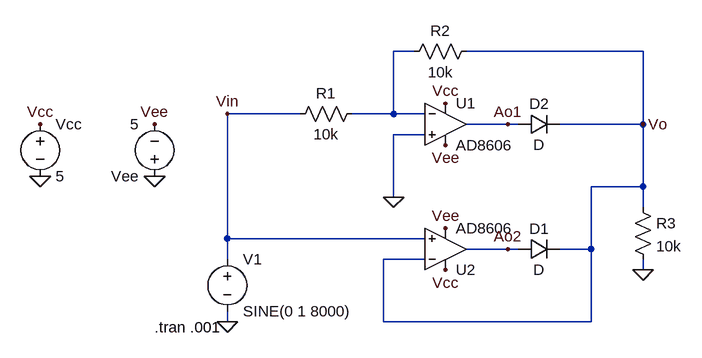
[diagram p0: schematic SuperDiodeFullWaveRectifier.asc]
SuperDiodeFullWaveRectifier.asc, the LTspice schematic file:
Version 4
SHEET 1 880 680
WIRE 160 32 128 32
WIRE 512 32 240 32
WIRE -16 128 -128 128
WIRE 128 128 128 32
WIRE 128 128 64 128
WIRE 176 128 128 128
WIRE 304 144 240 144
WIRE 320 144 304 144
WIRE 512 144 512 32
WIRE 512 144 384 144
WIRE 176 160 128 160
WIRE 512 240 512 144
WIRE 512 240 432 240
WIRE 128 256 128 160
WIRE 512 272 512 240
WIRE -128 320 -128 128
WIRE 176 320 -128 320
WIRE 304 336 240 336
WIRE 320 336 304 336
WIRE 432 336 432 240
WIRE 432 336 384 336
WIRE -128 352 -128 320
WIRE 176 352 112 352
WIRE 512 368 512 352
WIRE -128 448 -128 432
WIRE 112 448 112 352
WIRE 432 448 432 336
WIRE 432 448 112 448
FLAG -416 224 0
FLAG -240 224 0
FLAG 208 176 Vee
FLAG 208 112 Vcc
FLAG 512 368 0
FLAG 512 144 Vo
FLAG -128 128 Vin
FLAG -416 144 Vcc
FLAG -240 144 Vee
FLAG 128 256 0
FLAG 304 144 Ao1
FLAG 208 304 Vee
FLAG 208 368 Vcc
FLAG -128 448 0
FLAG 304 336 Ao2
SYMBOL voltage -416 128 R0
WINDOW 123 0 0 Left 0
WINDOW 39 0 0 Left 0
SYMATTR InstName Vcc
SYMATTR Value 5
SYMBOL voltage -240 240 R180
WINDOW 123 0 0 Left 0
WINDOW 39 0 0 Left 0
SYMATTR InstName Vee
SYMATTR Value 5
SYMBOL voltage -128 336 R0
WINDOW 123 0 0 Left 0
WINDOW 39 0 0 Left 0
SYMATTR InstName V1
SYMATTR Value SINE(0 1 8000)
SYMBOL res 496 256 R0
SYMATTR InstName R3
SYMATTR Value 10k
SYMBOL diode 320 160 R270
WINDOW 0 32 32 VTop 2
WINDOW 3 0 32 VBottom 2
SYMATTR InstName D2
SYMBOL OpAmps\\AD8606 208 80 R0
SYMATTR InstName U1
SYMBOL res 80 112 R90
WINDOW 0 0 56 VBottom 2
WINDOW 3 32 56 VTop 2
SYMATTR InstName R1
SYMATTR Value 10k
SYMBOL res 256 16 R90
WINDOW 0 0 56 VBottom 2
WINDOW 3 32 56 VTop 2
SYMATTR InstName R2
SYMATTR Value 10k
SYMBOL diode 320 352 R270
WINDOW 0 32 32 VTop 2
WINDOW 3 0 32 VBottom 2
SYMATTR InstName D1
SYMBOL OpAmps\\AD8606 208 400 M180
SYMATTR InstName U2
TEXT -240 456 Left 2 !.tran .001

The netlist it stands for:
* SuperDiodeFullWaveRectifier.asc
Vcc Vcc 0 5
Vee 0 Vee 5
V1 Vin 0 SINE(0 1 8000)
R3 Vo 0 10k
D2 Ao1 Vo D
XU1 0 N001 Vcc Vee Ao1 AD8606  ; pins In+ In- V+ V- OUT
R1 N001 Vin 10k
R2 Vo N001 10k
D1 Ao2 Vo D
XU2 Vin Vo Vcc Vee Ao2 AD8606  ; pins In+ In- V+ V- OUT
.model D D
.lib standard.dio
.tran .001
.lib ADI.lib
.backanno
.end